# EAGLE design ElectronThingyStick (EAGLE 7.4.0)
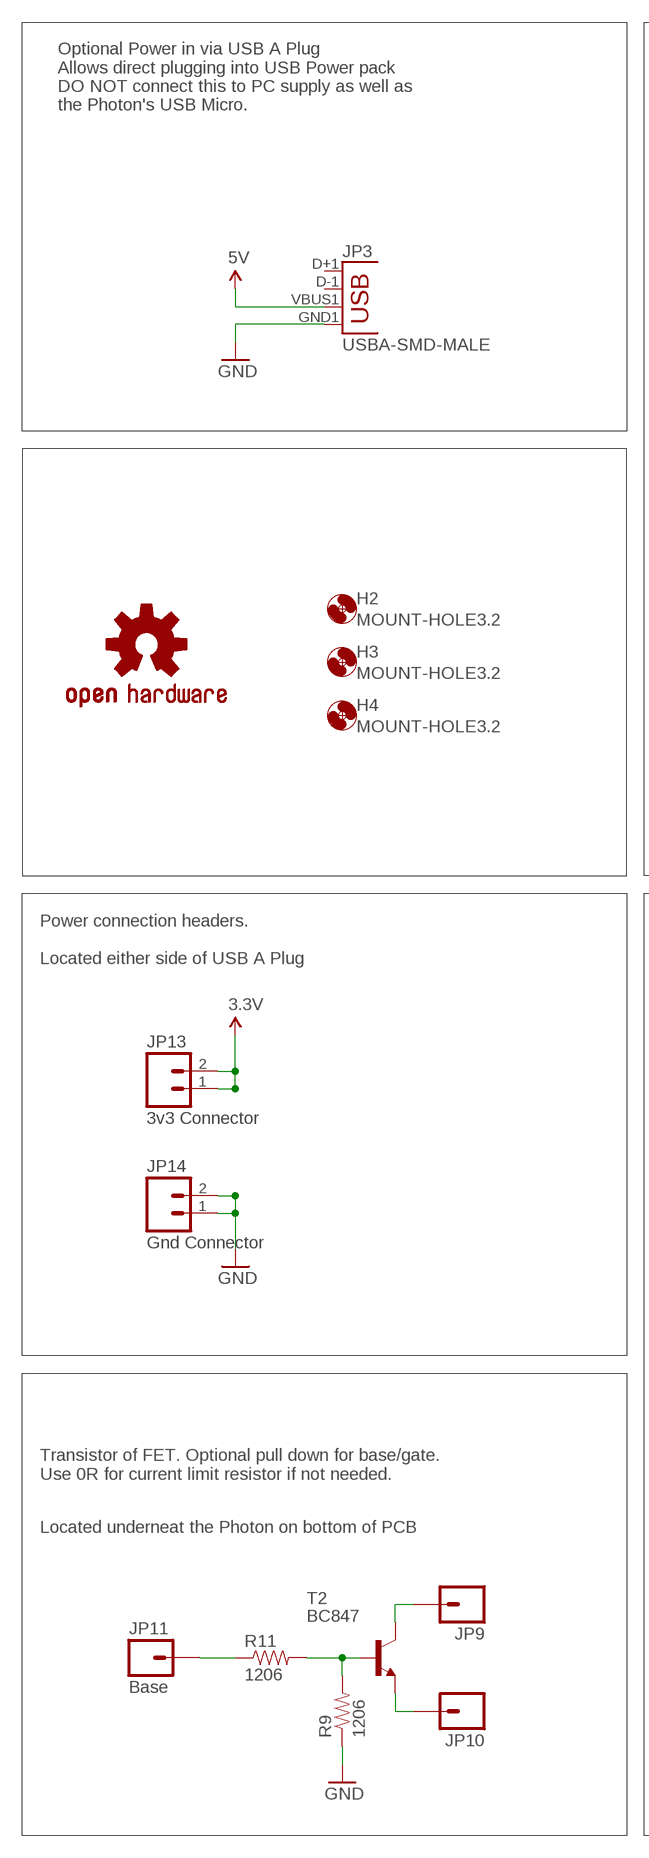
[diagram p0: schematic, sheet 1, part 1 of 2]
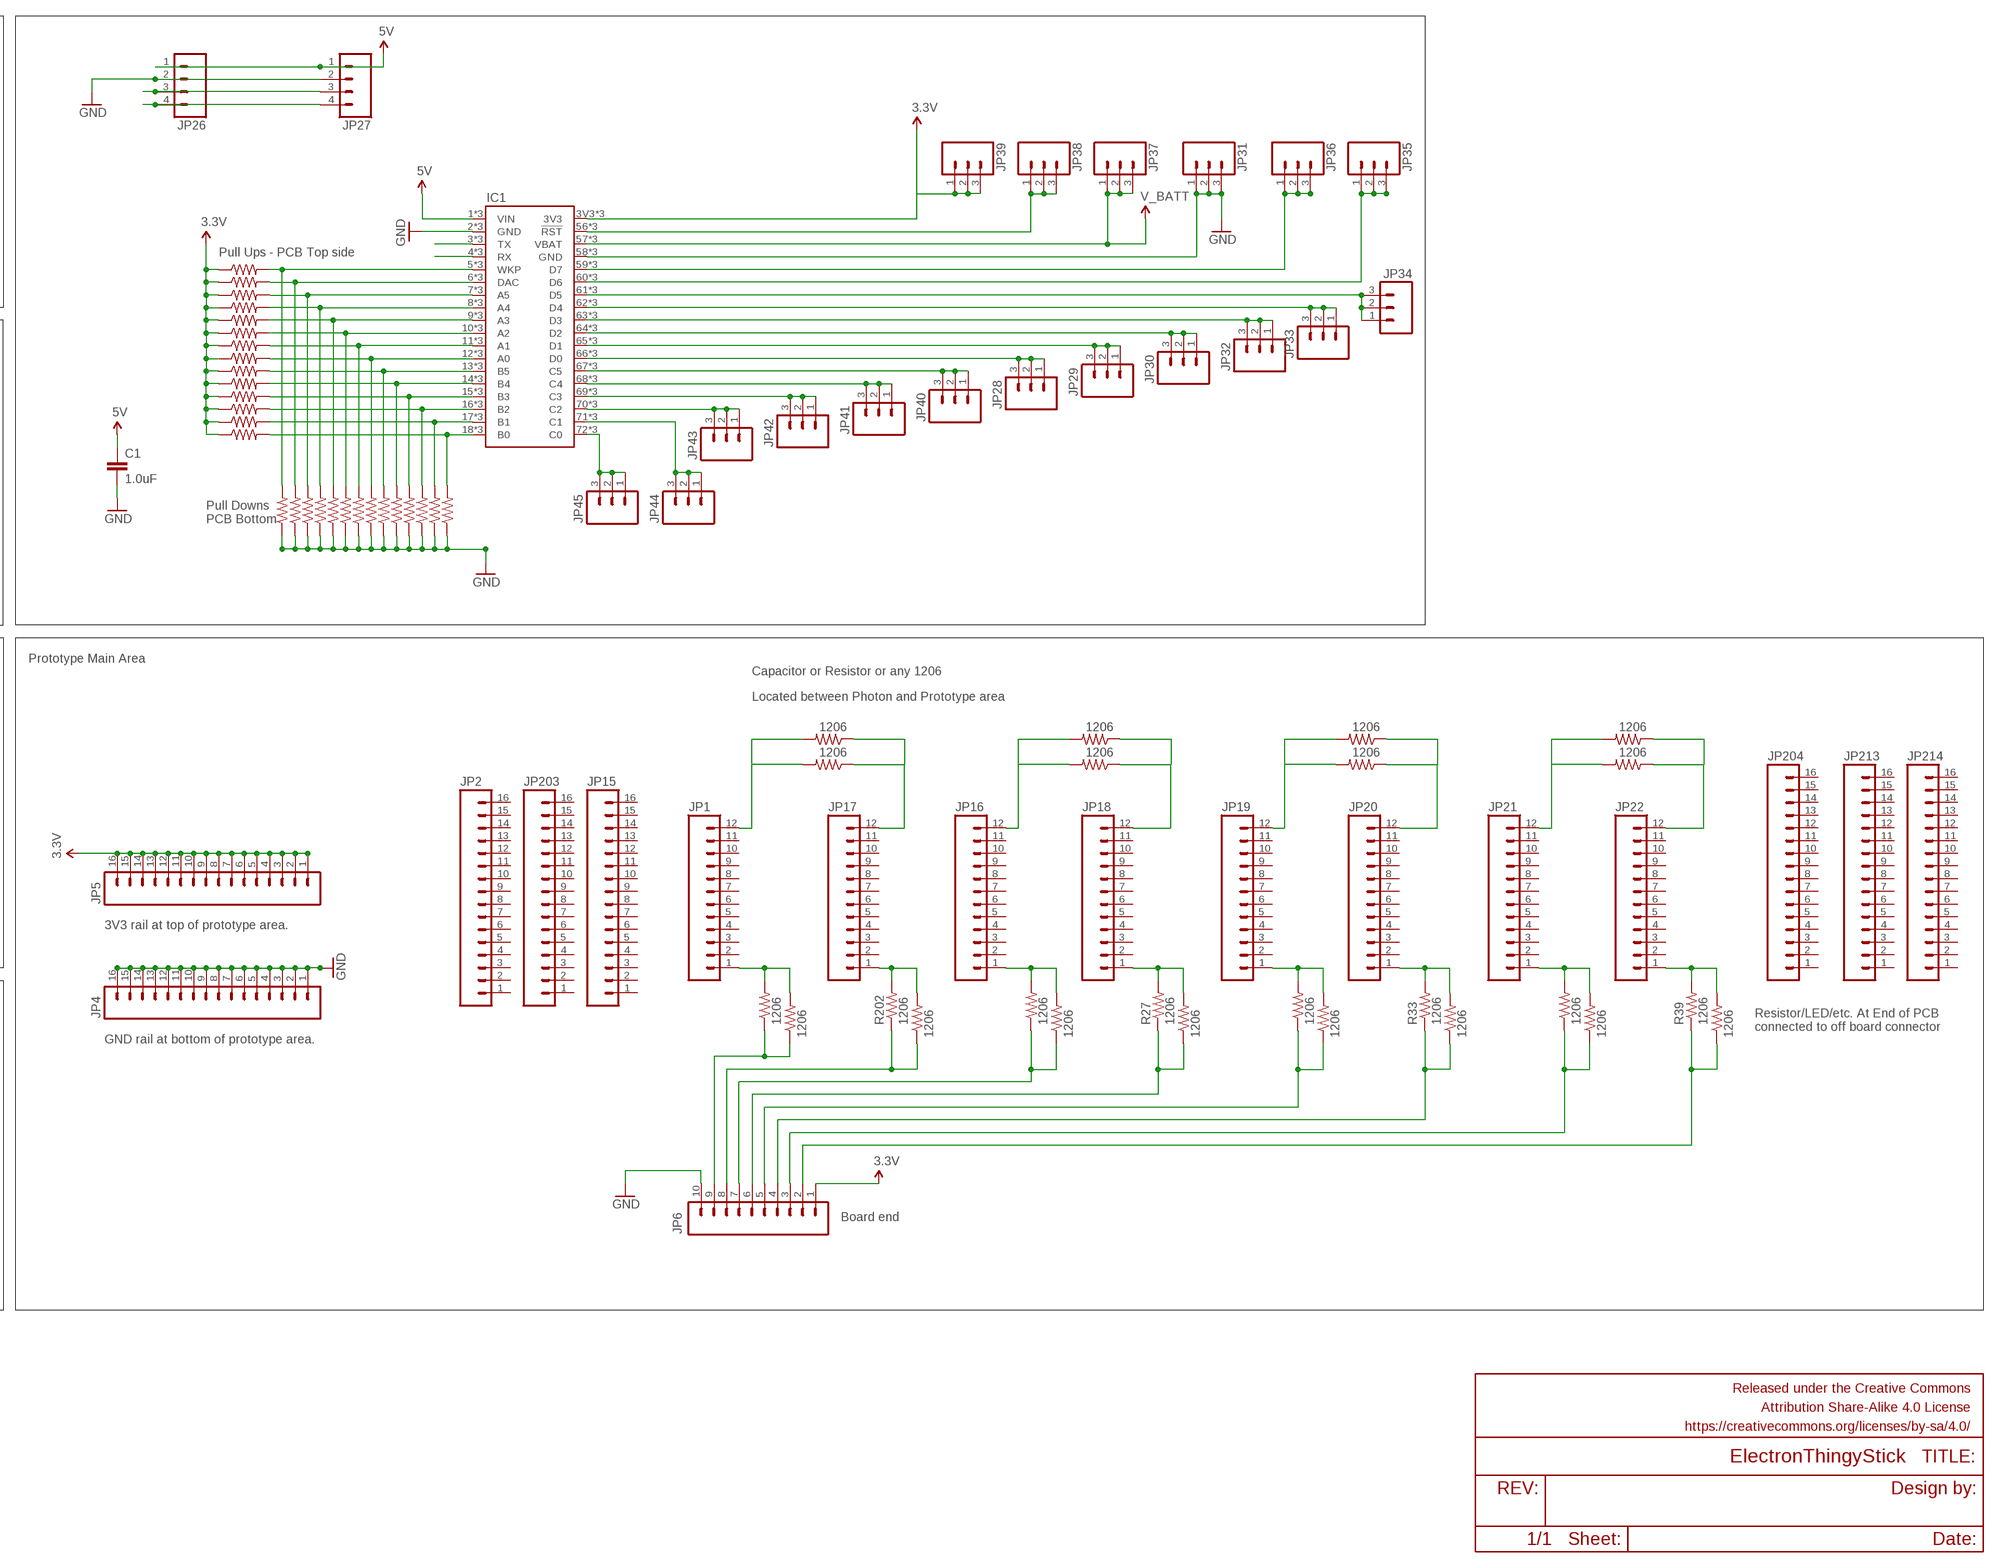
[diagram p1: schematic, sheet 1, part 2 of 2]

## Parts
C1  1.0uF  1.0UF-25V-+80/-20(0805)"  [0805-CAP]
FRAME1  FRAME-LEDGER  [CREATIVE_COMMONS]
H2  MOUNT-HOLE3.2  [3,2]
H3  MOUNT-HOLE3.2  [3,2]
H4  MOUNT-HOLE3.2  [3,2]
IC1  ELECTRONDUALROW  [ELECTRON_DUAL-ROW]
JP1  M12NO_SILK  [1X12_NO_SILK]
JP2  M161X16_NO_SILK  [1X16_NO_SILK]
JP3  USBA-SMD-MALE  [USB-A-SMT-MALE]
JP4  M16PTH  [1X16]
JP5  M16PTH  [1X16]
JP6  M10NO_SILK_PTH_FEMALE  [1X10_NO_SILK]
JP9  M01PTH  [1X01]
JP10  M01PTH  [1X01]
JP11  Base  M01PTH  [1X01]
JP13  3v3 Connector  M02PTH  [1X02]
JP14  Gnd Connector  M02PTH  [1X02]
JP15  M161X16_NO_SILK  [1X16_NO_SILK]
JP16  M12NO_SILK  [1X12_NO_SILK]
JP17  M12NO_SILK  [1X12_NO_SILK]
JP18  M12NO_SILK  [1X12_NO_SILK]
JP19  M12NO_SILK  [1X12_NO_SILK]
JP20  M12NO_SILK  [1X12_NO_SILK]
JP21  M12NO_SILK  [1X12_NO_SILK]
JP22  M12NO_SILK  [1X12_NO_SILK]
JP26  M041X04_NO_SILK  [1X04_NO_SILK]
JP27  M041X04_NO_SILK  [1X04_NO_SILK]
JP28  M03PTH  [1X03]
JP29  M03PTH  [1X03]
JP30  M03PTH  [1X03]
JP31  M03PTH  [1X03]
JP32  M03PTH  [1X03]
JP33  M03PTH  [1X03]
JP34  M03PTH  [1X03]
JP35  M03PTH  [1X03]
JP36  M03PTH  [1X03]
JP37  M03PTH  [1X03]
JP38  M03PTH  [1X03]
JP39  M03PTH  [1X03]
JP40  M03PTH  [1X03]
JP41  M03PTH  [1X03]
JP42  M03PTH  [1X03]
JP43  M03PTH  [1X03]
JP44  M03PTH  [1X03]
JP45  M03PTH  [1X03]
JP203  M161X16_NO_SILK  [1X16_NO_SILK]
JP204  M161X16_NO_SILK  [1X16_NO_SILK]
JP213  M161X16_NO_SILK  [1X16_NO_SILK]
JP214  M161X16_NO_SILK  [1X16_NO_SILK]
LOGO1  OSHW-LOGOM  [OSHW-LOGO-M]
R1  1206  RESISTOR1206  [1206]
R2  1206  RESISTOR1206  [1206]
R3  1206  RESISTOR1206  [1206]
R4  1206  RESISTOR1206  [1206]
R5  1206  RESISTOR1206  [1206]
R6  1206  RESISTOR1206  [1206]
R7  1206  RESISTOR1206  [1206]
R8  1206  RESISTOR1206  [1206]
R9  1206  RESISTOR1206  [1206]
R10  1206  RESISTOR1206  [1206]
R11  1206  RESISTOR1206  [1206]
R12  1206  RESISTOR1206  [1206]
R13  1206  RESISTOR1206  [1206]
R14  1206  RESISTOR1206  [1206]
R15  1206  RESISTOR1206  [1206]
R16  1206  RESISTOR1206  [1206]
R17  1206  RESISTOR1206  [1206]
R18  1206  RESISTOR1206  [1206]
R19  1206  RESISTOR1206  [1206]
R20  1206  RESISTOR1206  [1206]
R21  1206  RESISTOR1206  [1206]
R22  1206  RESISTOR1206  [1206]
R23  1206  RESISTOR1206  [1206]
R24  1206  RESISTOR1206  [1206]
R25  1206  RESISTOR1206  [1206]
R26  1206  RESISTOR1206  [1206]
R27  1206  RESISTOR1206  [1206]
R28  1206  RESISTOR1206  [1206]
R29  1206  RESISTOR1206  [1206]
R30  1206  RESISTOR1206  [1206]
R31  1206  RESISTOR1206  [1206]
R32  1206  RESISTOR1206  [1206]
R33  1206  RESISTOR1206  [1206]
R34  1206  RESISTOR1206  [1206]
R35  1206  RESISTOR1206  [1206]
R36  1206  RESISTOR1206  [1206]
R37  1206  RESISTOR1206  [1206]
R38  1206  RESISTOR1206  [1206]
R39  1206  RESISTOR1206  [1206]
R40  1206  RESISTOR1206  [1206]
R41  1206  RESISTOR1206  [1206]
R42  1206  RESISTOR1206  [1206]
R43  1206  RESISTOR1206  [1206]
R44  1206  RESISTOR1206  [1206]
R45  1206  RESISTOR1206  [1206]
R46  1206  RESISTOR1206  [1206]
R47  1206  RESISTOR1206  [1206]
R48  1206  RESISTOR1206  [1206]
R49  1206  RESISTOR1206  [1206]
R50  1206  RESISTOR1206  [1206]
R51  1206  RESISTOR1206  [1206]
R52  1206  RESISTOR1206  [1206]
R201  1206  RESISTOR1206  [1206]
R202  1206  RESISTOR1206  [1206]
T2  BC847  [SOT23]

## Nets
3.3V: IC1.3V3 IC1.55(3V3) IC1.91(3V3) JP5.1 JP5.2 JP5.3 JP5.4 JP5.5 JP5.6 JP5.7 JP5.8 JP5.9 JP5.10 JP5.11 JP5.12 JP5.13 JP5.14 JP5.15 JP5.16 JP6.1 JP13.1 JP13.2 JP39.1 JP39.2 JP39.3 R1.1 R2.1 R3.1 R4.1 R5.1 R6.1 R7.1 R12.1 R15.1 R16.1 R17.1 R18.1 R45.1 R46.1
5V: C1.1 IC1.1(VIN) IC1.37(VIN) IC1.VIN JP3.VBUS1(VBUS) JP26.1 JP27.1
GND: C1.2 IC1.2(GND) IC1.38(GND) IC1.58(GND) IC1.94(GND) IC1.GND IC1.GND@2(GND) JP3.GND1(GND) JP4.1 JP4.2 JP4.3 JP4.4 JP4.5 JP4.6 JP4.7 JP4.8 JP4.9 JP4.10 JP4.11 JP4.12 JP4.13 JP4.14 JP4.15 JP4.16 JP6.10 JP14.1 JP14.2 JP26.2 JP27.2 JP31.1 JP31.2 JP31.3 R8.1 R9.1 R10.1 R13.1 R14.1 R19.1 R20.1 R21.1 R22.1 R47.1 R48.1 R49.1 R50.1 R51.1 R52.1
N$1: IC1.67(C5) IC1.103(C5) IC1.C5 JP40.1 JP40.2 JP40.3
N$2: JP17.1 R26.2 R202.2
N$3: JP1.1 R23.2 R201.2
N$4: IC1.68(C4) IC1.104(C4) IC1.C4 JP41.1 JP41.2 JP41.3
N$5: IC1.69(C3) IC1.105(C3) IC1.C3 JP42.1 JP42.2 JP42.3
N$6: IC1.5(WKP) IC1.41(WKP) IC1.WKP R8.2 R12.2
N$7: IC1.6(DAC) IC1.42(DAC) IC1.DAC R5.2 R10.2
N$8: IC1.7(A5) IC1.43(A5) IC1.A5 R1.2 R13.2
N$9: IC1.8(A4) IC1.44(A4) IC1.A4 R2.2 R14.2
N$10: IC1.9(A3) IC1.45(A3) IC1.A3 R3.2 R19.2
N$11: IC1.10(A2) IC1.46(A2) IC1.A2 R4.2 R20.2
N$12: IC1.11(A1) IC1.47(A1) IC1.A1 R6.2 R21.2
N$13: IC1.12(A0) IC1.48(A0) IC1.A0 R7.2 R22.2
N$14: JP6.9 R23.1 R201.1
N$15: IC1.70(C2) IC1.106(C2) IC1.C2 JP43.1 JP43.2 JP43.3
N$16: IC1.61(D5) IC1.97(D5) IC1.D5 JP34.1 JP34.2 JP34.3
N$17: IC1.62(D4) IC1.98(D4) IC1.D4 JP33.1 JP33.2 JP33.3
N$18: IC1.63(D3) IC1.99(D3) IC1.D3 JP32.1 JP32.2 JP32.3
N$19: IC1.64(D2) IC1.100(D2) IC1.D2 JP30.1 JP30.2 JP30.3
N$20: IC1.65(D1) IC1.101(D1) IC1.D1 JP29.1 JP29.2 JP29.3
N$21: IC1.66(D0) IC1.102(D0) IC1.D0 JP28.1 JP28.2 JP28.3
N$22: IC1.13(B5) IC1.49(B5) IC1.B5 R15.2 R47.2
N$23: JP1.12 R24.2 R25.2
N$24: IC1.56(!RST) IC1.92(!RST) IC1.RST(!RST) JP38.1 JP38.2 JP38.3
N$25: IC1.71(C1) IC1.107(C1) IC1.C1 JP44.1 JP44.2 JP44.3
N$26: JP17.12 R24.1 R25.1
N$27: IC1.72(C0) IC1.108(C0) IC1.C0 JP45.1 JP45.2 JP45.3
N$28: JP6.8 R26.1 R202.1
N$29: JP18.1 R27.2 R32.2
N$30: JP16.1 R28.2 R29.2
N$31: JP6.7 R28.1 R29.1
N$32: IC1.14(B4) IC1.50(B4) IC1.B4 R16.2 R48.2
N$33: JP16.12 R30.2 R31.2
N$34: JP18.12 R30.1 R31.1
N$35: IC1.15(B3) IC1.51(B3) IC1.B3 R17.2 R49.2
N$36: JP6.6 R27.1 R32.1
N$37: JP20.1 R33.2 R38.2
N$38: IC1.59(D7) IC1.95(D7) IC1.D7 JP36.1 JP36.2 JP36.3
N$39: IC1.60(D6) IC1.96(D6) IC1.D6 JP35.1 JP35.2 JP35.3
N$40: JP19.1 R34.2 R35.2
N$41: IC1.16(B2) IC1.52(B2) IC1.B2 R18.2 R50.2
N$43: JP6.5 R34.1 R35.1
N$44: IC1.17(B1) IC1.53(B1) IC1.B1 R45.2 R51.2
N$45: IC1.18(B0) IC1.54(B0) IC1.B0 R46.2 R52.2
N$53: JP19.12 R36.2 R37.2
N$54: JP20.12 R36.1 R37.1
N$57: JP6.4 R33.1 R38.1
N$58: JP22.1 R39.2 R44.2
N$59: JP11.1 R11.1
N$60: R9.2 R11.2 T2.1(B)
N$61: JP9.1 T2.3(C)
N$62: JP10.1 T2.2(E)
N$63: JP21.1 R40.2 R41.2
N$64: JP6.3 R40.1 R41.1
N$68: JP21.12 R42.2 R43.2
N$69: JP22.12 R42.1 R43.1
N$72: JP6.2 R39.1 R44.1
RX: IC1.4(RX) IC1.40(RX) IC1.RX JP26.4 JP27.4
TX: IC1.3(TX) IC1.39(TX) IC1.TX JP26.3 JP27.3
V_BATT: IC1.57(VBAT) IC1.93(VBAT) IC1.VBAT JP37.1 JP37.2 JP37.3
Unconnected: JP1.2 JP1.3 JP1.4 JP1.5 JP1.6 JP1.7 JP1.8 JP1.9 JP1.10 JP1.11 JP2.1 JP2.2 JP2.3 JP2.4 JP2.5 JP2.6 JP2.7 JP2.8 JP2.9 JP2.10 JP2.11 JP2.12 JP2.13 JP2.14 JP2.15 JP2.16 JP3.D+1(D+) JP3.D-1(D-) JP15.1 JP15.2 JP15.3 JP15.4 JP15.5 JP15.6 JP15.7 JP15.8 JP15.9 JP15.10 JP15.11 JP15.12 JP15.13 JP15.14 JP15.15 JP15.16 JP16.2 JP16.3 JP16.4 JP16.5 JP16.6 JP16.7 JP16.8 JP16.9 JP16.10 JP16.11 JP17.2 JP17.3 JP17.4 JP17.5 JP17.6 JP17.7 JP17.8 JP17.9 JP17.10 JP17.11 JP18.2 JP18.3 JP18.4 JP18.5 JP18.6 JP18.7 JP18.8 JP18.9 JP18.10 JP18.11 JP19.2 JP19.3 JP19.4 JP19.5 JP19.6 JP19.7 JP19.8 JP19.9 JP19.10 JP19.11 JP20.2 JP20.3 JP20.4 JP20.5 JP20.6 JP20.7 JP20.8 JP20.9 JP20.10 JP20.11 JP21.2 JP21.3 JP21.4 JP21.5 JP21.6 JP21.7 JP21.8 JP21.9 JP21.10 JP21.11 JP22.2 JP22.3 JP22.4 JP22.5 JP22.6 JP22.7 JP22.8 JP22.9 JP22.10 JP22.11 JP203.1 JP203.2 JP203.3 JP203.4 JP203.5 JP203.6 JP203.7 JP203.8 JP203.9 JP203.10 JP203.11 JP203.12 JP203.13 JP203.14 JP203.15 JP203.16 JP204.1 JP204.2 JP204.3 JP204.4 JP204.5 JP204.6 JP204.7 JP204.8 JP204.9 JP204.10 JP204.11 JP204.12 JP204.13 JP204.14 JP204.15 JP204.16 JP213.1 JP213.2 JP213.3 JP213.4 JP213.5 JP213.6 JP213.7 JP213.8 JP213.9 JP213.10 JP213.11 JP213.12 JP213.13 JP213.14 JP213.15 JP213.16 JP214.1 JP214.2 JP214.3 JP214.4 JP214.5 JP214.6 JP214.7 JP214.8 JP214.9 JP214.10 JP214.11 JP214.12 JP214.13 JP214.14 JP214.15 JP214.16

## Notes on the sheet
- Optional Power in via USB A Plug
  Allows direct plugging into USB Power pack
  DO NOT connect this to PC supply as well as
  the Photon's USB Micro.
- Pull Ups - PCB Top side
- Pull Downs
  PCB Bottom
- Prototype Main Area
- Capacitor or Resistor or any 1206
- Power connection headers.
  
  Located either side of USB A Plug
- Located between Photon and Prototype area
- 3V3 rail at top of prototype area.
- Resistor/LED/etc. At End of PCB 
  connected to off board connector
- GND rail at bottom of prototype area.
- Transistor of FET. Optional pull down for base/gate.
  Use 0R for current limit resistor if not needed.
- Located underneat the Photon on bottom of PCB
- Board end

## Library data of the parts
C1 = SparkFun-Capacitors:1.0UF-25V-+80/-20(0805): CAP-11625; PROD_ID: CAP-11625
FRAME1 = SparkFun-Aesthetics:FRAME-LEDGER: Schematic Frame Standard 11x14 US Ledger frame
H2-H4 = holes:MOUNT-HOLE: MOUNTING HOLE with drill center marker
IC1 = Tinamous:ELECTRON
JP1 JP16-JP22 = SparkFun-Connectors:M12: Header 12 Standard 12-pin 0.1" header. Use with straight break away headers (SKU : PRT-00116), right angle break away headers (PRT-00553), swiss pins (PRT-00743), machine pins (PRT-00117), and female headers (PRT-00115).
JP2 JP4 JP5 JP15 JP203 JP204 JP213 JP214 = SparkFun-Connectors:M16: 1x16 .1" header
JP3 = SparkFun-Connectors:USB: USB Connectors USB-B-PTH is fully proven SKU : PRT-00139/CONN-08278 USB-miniB is fully proven SKU : PRT-00587 USB-A-PCB is untested. USB-A-H is throughly reviewed, but untested. Spark Fun Electronics SKU : PRT-00437 USB-B-SMT is throughly reviewed, but untested. Needs silkscreen touching up. USB-A-S has not been used/tested USB-MB-H has not been used/tested USB-MICROB has been used. CONN-09505
JP6 = SparkFun-Connectors:M10: Header 10 Standard 10-pin 0.1" header. Use with straight break away headers (SKU : PRT-00116), right angle break away headers (PRT-00553), swiss pins (PRT-00743), machine pins (PRT-00117), and female headers (PRT-00115).; PROD_ID: CONN-11563
JP9-JP11 = SparkFun-Connectors:M01: Header 1 Standard 1-pin 0.1" header. Use with straight break away headers (SKU : PRT-00116), right angle break away headers (PRT-00553), swiss pins (PRT-00743), machine pins (PRT-00117), and female headers (PRT-00115).
JP13 JP14 = SparkFun-Connectors:M02: Standard 2-pin 0.1" header. Use with - straight break away headers ( PRT-00116) - right angle break away headers (PRT-00553) - swiss pins (PRT-00743) - machine pins (PRT-00117) - female headers (PRT-00115) Molex polarized connector foot print use with: PRT-08233 with associated crimp pins and housings. 2.54_SCREWTERM for use with PRT-10571. 3.5mm Screw Terminal footprints for PRT-08084 5mm Screw Terminal footprints for use with PRT-08432
JP26 JP27 = SparkFun-Connectors:M04: Header 4 Standard 4-pin 0.1" header. Use with straight break away headers (SKU : PRT-00116), right angle break away headers (PRT-00553), swiss pins (PRT-00743), machine pins (PRT-00117), and female headers (PRT-00115). Molex polarized connector foot print use with SKU : PRT-08231 with associated crimp pins and housings. 1MM SMD Version SKU: PRT-10208
JP28-JP45 = SparkFun-Connectors:M03: Header 3 Standard 3-pin 0.1" header. Use with straight break away headers (SKU : PRT-00116), right angle break away headers (PRT-00553), swiss pins (PRT-00743), machine pins (PRT-00117), and female headers (PRT-00115). Molex polarized connector foot print use with SKU : PRT-08232 with associated crimp pins and housings.
LOGO1 = SparkFun-Aesthetics:OSHW-LOGO: Open Source Hardware Logo This logo indicates the piece of hardware it is found on incorporates a OSHW license and/or adheres to the definition of open source hardware found here: http://freedomdefined.org/OSHW
R1-R8 R10 R12-R52 R201 R202 = SparkFun-Resistors:RESISTOR: Resistor Basic schematic elements and footprints for 0603, 1206, and PTH resistors.
R9 R11 = SparkFun-Passives:RESISTOR: Resistor Basic schematic elements and footprints for 0603, 1206, and PTH resistors.
T2 = transistor-neu-to92:BC847: NPN TRANSISTOR

## Board
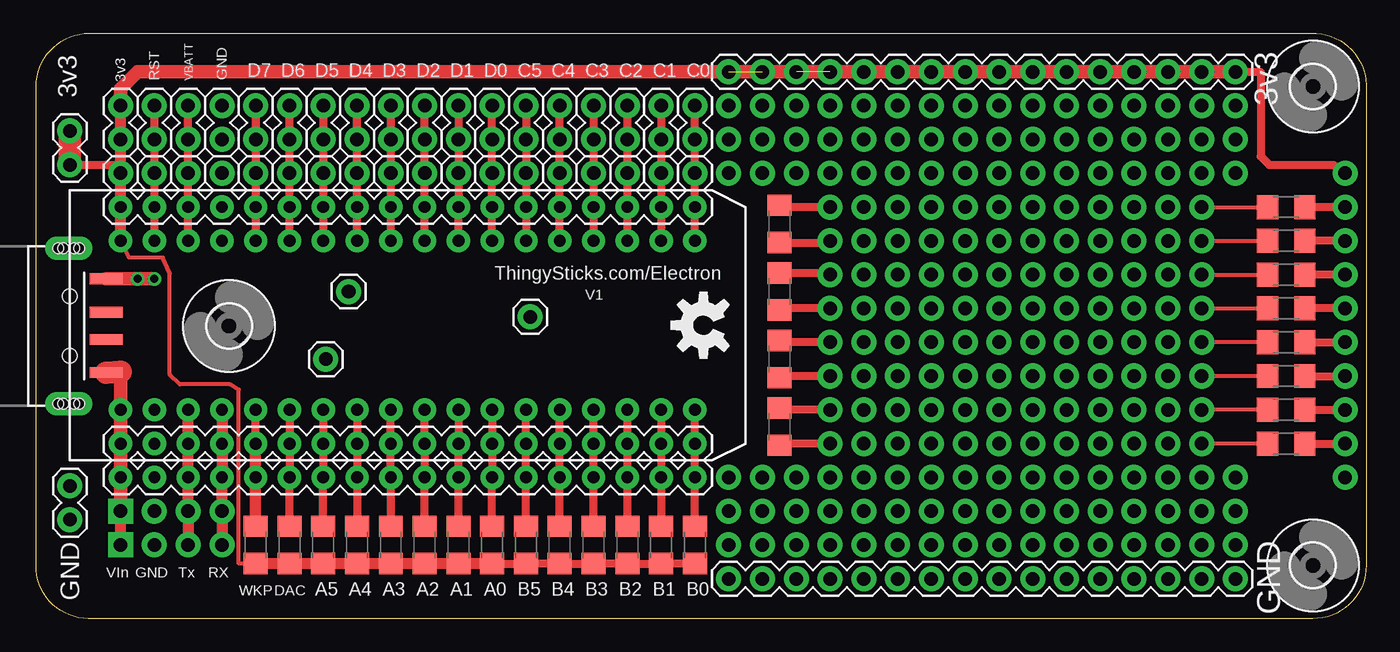
[diagram p2: board, top side]
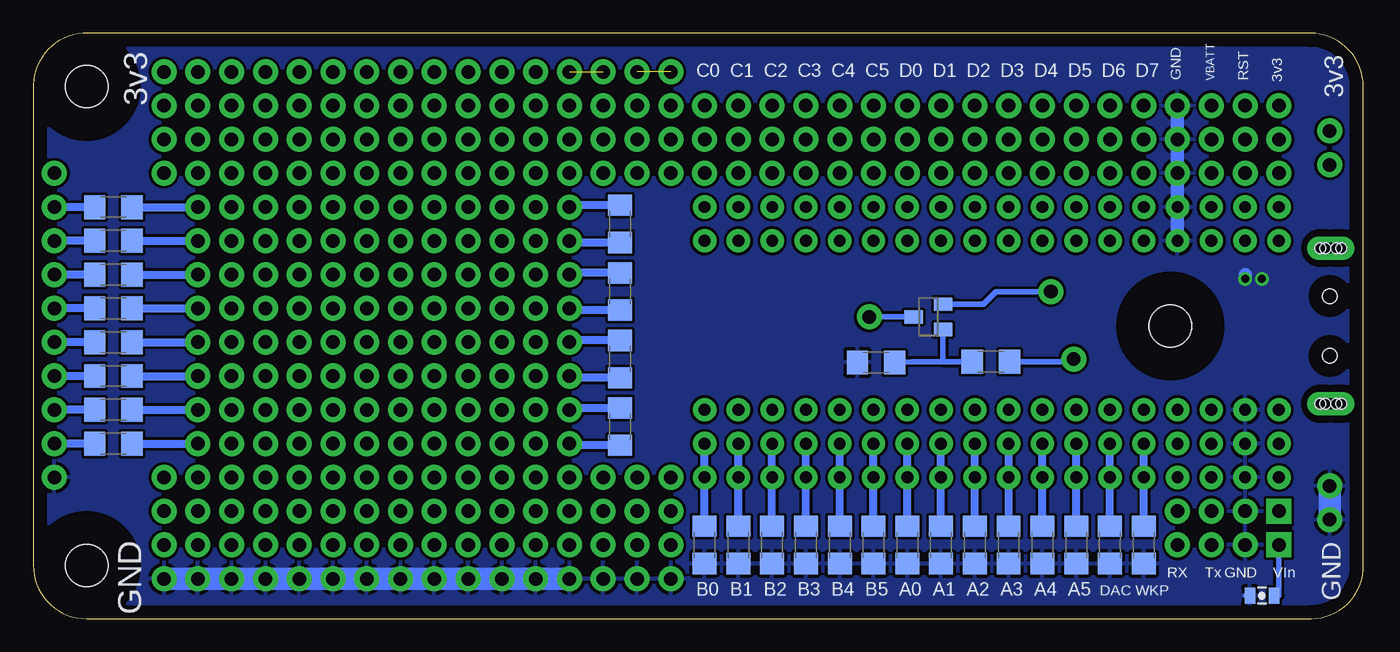
[diagram p3: board, bottom side, seen from below]

Size 100.01 x 44 mm. Coordinates in mm from the lower left corner, seen from the top.
Outline: 0,4 arc90 3.9,0 96,0 arc90 100,4 100,39.75 arc90 96.25,44 4,44 arc90 0,40 0,3.72
Copper layers (1*16): Top 0.035mm / dielectric 1.5mm / Bottom 0.035mm
Design rules "default": minimum track width 10mil, minimum drill 24mil, track to track 8mil, track to pad 8mil, pad to pad 8mil, via to via 8mil, smd to smd 8mil, copper to edge 40mil, drill to drill 8mil, minimum pad ring 10mil, minimum via ring 8mil, stop-mask expansion 4mil, vias tented up to drill 0mil, thermal gap 10mil

### Footprints (pad centres in the part's own frame; a part is rotated, then mirrored left to right if it is on the bottom)
0805-CAP = smd 0.8 x 1.2: 1 -0.9,0; 2 0.9,0
3,2 = hole 3.2: 0,0
ELECTRON_DUAL-ROW = drill 0.889 pad 1.753: 1 1.27,2.54; 2 3.81,2.54; 3 6.35,2.54; 3V3 1.27,22.86; 4 8.89,2.54; 5 11.43,2.54; 6 13.97,2.54; 7 16.51,2.54; 8 19.05,2.54; 9 21.59,2.54; 10 24.13,2.54; 11 26.67,2.54; 12 29.21,2.54; 13 31.75,2.54; 14 34.29,2.54; 15 36.83,2.54; 16 39.37,2.54; 17 41.91,2.54; 18 44.45,2.54; 37 1.27,7.62; 38 3.81,7.62; 39 6.35,7.62; 40 8.89,7.62; 41 11.43,7.62; 42 13.97,7.62; 43 16.51,7.62; 44 19.05,7.62; 45 21.59,7.62; 46 24.13,7.62; 47 26.67,7.62; 48 29.21,7.62; 49 31.75,7.62; 50 34.29,7.62; 51 36.83,7.62; 52 39.37,7.62; 53 41.91,7.62; 54 44.45,7.62; 55 1.27,20.32; 56 3.81,20.32; 57 6.35,20.32; 58 8.89,20.32; 59 11.43,20.32; 60 13.97,20.32; 61 16.51,20.32; 62 19.05,20.32; 63 21.59,20.32; 64 24.13,20.32; 65 26.67,20.32; 66 29.21,20.32; 67 31.75,20.32; 68 34.29,20.32; 69 36.83,20.32; 70 39.37,20.32; 71 41.91,20.32; 72 44.45,20.32; 91 1.27,25.4; 92 3.81,25.4; 93 6.35,25.4; 94 8.89,25.4; 95 11.43,25.4; 96 13.97,25.4; 97 16.51,25.4; 98 19.05,25.4; 99 21.59,25.4; 100 24.13,25.4; 101 26.67,25.4; 102 29.21,25.4; 103 31.75,25.4; 104 34.29,25.4; 105 36.83,25.4; 106 39.37,25.4; 107 41.91,25.4; 108 44.45,25.4; A0 29.21,5.08; A1 26.67,5.08; A2 24.13,5.08; A3 21.59,5.08; A4 19.05,5.08; A5 16.51,5.08; B0 44.45,5.08; B1 41.91,5.08; B2 39.37,5.08; B3 36.83,5.08; B4 34.29,5.08; B5 31.75,5.08; C0 44.45,22.86; C1 41.91,22.86; C2 39.37,22.86; C3 36.83,22.86; C4 34.29,22.86; C5 31.75,22.86; D0 29.21,22.86; D1 26.67,22.86; D2 24.13,22.86; D3 21.59,22.86; D4 19.05,22.86; D5 16.51,22.86; D6 13.97,22.86; D7 11.43,22.86; DAC 13.97,5.08; GND 8.89,22.86; GND@2 3.81,5.08; RST 3.81,22.86; RX 8.89,5.08; TX 6.35,5.08; VBAT 6.35,22.86; VIN 1.27,5.08; WKP 11.43,5.08
1X12_NO_SILK = drill 1.016 pad 1.88: 1 0,0; 2 2.54,0; 3 5.08,0; 4 7.62,0; 5 10.16,0; 6 12.7,0; 7 15.24,0; 8 17.78,0; 9 20.32,0; 10 22.86,0; 11 25.4,0; 12 27.94,0
1X16_NO_SILK = drill 1.016 pad 1.88: 1 0,0; 2 2.54,0; 3 5.08,0; 4 7.62,0; 5 10.16,0; 6 12.7,0; 7 15.24,0; 8 17.78,0; 9 20.32,0; 10 22.86,0; 11 25.4,0; 12 27.94,0; 13 30.48,0; 14 33.02,0; 15 35.56,0; 16 38.1,0
USB-A-SMT-MALE = smd 0.8 x 2.5: D+1 1.027,-5.87; D-1 -1.027,-5.87; GND1 3.551,-5.87; VBUS1 -3.5,-5.87 | drill 0.8 pad 1.778 long: P$1 5.85,-3.05; P$3 -5.85,-3.05 | hole 1.1: 2.25,-3.12; -2.25,-3.12 | hole 0.8: -5.85,-3.45; -5.85,-3.85; -5.85,-2.65; -5.85,-2.25; 5.85,-3.45; 5.85,-3.85; 5.85,-2.65; 5.85,-2.25
1X16 = drill 1.016 pad 1.88: 1 0,0; 2 2.54,0; 3 5.08,0; 4 7.62,0; 5 10.16,0; 6 12.7,0; 7 15.24,0; 8 17.78,0; 9 20.32,0; 10 22.86,0; 11 25.4,0; 12 27.94,0; 13 30.48,0; 14 33.02,0; 15 35.56,0; 16 38.1,0
1X10_NO_SILK = drill 1.016 pad 1.88: 1 0,0; 2 2.54,0; 3 5.08,0; 4 7.62,0; 5 10.16,0; 6 12.7,0; 7 15.24,0; 8 17.78,0; 9 20.32,0; 10 22.86,0
1X01 = drill 1.016 pad 1.88: 1 0,0
1X02 = drill 1.016 pad 1.88: 1 0,0; 2 2.54,0
1X04_NO_SILK = drill 1.016 pad 1.88 square: 1 0,0 | drill 1.016 pad 1.88: 2 2.54,0; 3 5.08,0; 4 7.62,0
1X03 = drill 1.016 pad 1.88: 1 0,0; 2 2.54,0; 3 5.08,0
1206 = smd 1.6 x 1.8: 1 -1.4,0; 2 1.4,0
SOT23 = smd 1 x 1.4: 1 -0.95,-1.1; 2 0.95,-1.1; 3 0,1.1

### Placement (x,y rotation side)
C1  7.62,1.73 180 bottom
FRAME1  23.36,-13.27 0 top  (outside the outline)
H2  14.5,22 0 top
H3  96,40 0 top
H4  96,4 0 top
IC1  5.08,8.08 0 top
JP1  87.63,13.16 180 top
JP2  90.17,38.56 180 top
JP3  -0.6,22 90 top
JP4  90.17,3 180 top
JP5  90.17,41.1 180 top
JP6  98.42,33.48 270 top
JP9  37.15,22.68 0 top
JP10  23.5,24.59 0 top
JP11  21.78,19.51 0 top
JP13  2.54,34.11 90 top
JP14  2.54,9.98 270 top
JP15  90.17,5.54 180 top
JP16  87.63,18.24 180 top
JP17  87.63,15.7 180 top
JP18  87.63,20.78 180 top
JP19  87.63,23.32 180 top
JP20  87.63,25.86 180 top
JP21  87.63,28.4 180 top
JP22  87.63,30.94 180 top
JP26  6.35,5.54 0 top
JP27  6.35,8.08 0 top
JP28  34.29,33.48 90 top
JP29  31.75,33.48 90 top
JP30  29.21,38.56 270 top
JP31  13.97,33.48 90 top
JP32  26.67,38.56 270 top
JP33  24.13,38.56 270 top
JP34  21.59,38.56 270 top
JP35  19.05,38.56 270 top
JP36  16.51,38.56 270 top
JP37  11.43,33.48 90 top
JP38  8.89,33.48 90 top
JP39  6.35,33.48 90 top
JP40  36.83,33.48 90 top
JP41  39.37,33.48 90 top
JP42  41.91,33.48 90 top
JP43  44.45,33.48 90 top
JP44  46.99,33.48 90 top
JP45  49.53,33.48 90 top
JP203  90.17,36.02 180 top
JP204  90.17,33.48 180 top
JP213  90.17,10.62 180 top
JP214  90.17,8.08 180 top
LOGO1  50.16,22.05 90 top
R1  21.59,5.54 90 top
R2  24.13,5.54 90 top
R3  26.67,5.54 90 top
R4  29.21,5.54 90 top
R5  19.05,5.54 90 top
R6  31.75,5.54 90 top
R7  34.29,5.54 90 top
R8  16.51,5.54 90 bottom
R9  36.64,19.26 0 bottom
R10  19.05,5.54 90 bottom
R11  28,19.32 180 bottom
R12  16.51,5.54 90 top
R13  21.59,5.54 90 bottom
R14  24.13,5.54 90 bottom
R15  36.83,5.54 90 top
R16  39.37,5.54 90 top
R17  41.91,5.54 90 top
R18  44.45,5.54 90 top
R19  26.67,5.54 90 bottom
R20  29.21,5.54 90 bottom
R21  31.75,5.54 90 bottom
R22  34.29,5.54 90 bottom
R23  93.98,13.16 0 bottom
R24  55.88,14.43 270 top
R25  55.88,14.43 270 bottom
R26  93.98,15.7 0 bottom
R27  93.98,20.78 180 top
R28  93.98,18.24 180 top
R29  93.98,18.24 0 bottom
R30  55.88,19.51 270 top
R31  55.88,19.51 270 bottom
R32  93.98,20.78 0 bottom
R33  93.98,25.86 180 top
R34  93.98,23.32 180 top
R35  93.98,23.32 0 bottom
R36  55.88,24.59 270 top
R37  55.88,24.59 270 bottom
R38  93.98,25.86 0 bottom
R39  93.98,30.94 180 top
R40  93.98,28.4 180 top
R41  93.98,28.4 0 bottom
R42  55.88,29.67 270 top
R43  55.88,29.67 270 bottom
R44  93.98,30.94 0 bottom
R45  46.99,5.54 90 top
R46  49.53,5.54 90 top
R47  36.83,5.54 90 bottom
R48  39.37,5.54 90 bottom
R49  41.91,5.54 90 bottom
R50  44.45,5.54 90 bottom
R51  46.99,5.54 90 bottom
R52  49.53,5.54 90 bottom
R201  93.98,13.16 180 top
R202  93.98,15.7 180 top
T2  32.7,22.68 90 bottom

### Tracks (layer width: path | path; a pad name or v marks a point on that pad's centre or on a via)
3.3V  (2 unrouted)
  Top 0.305: R12.1 15.24,4.14 15.24,17.22 14.61,17.61 10.79,17.61 10.06,18.34 10.06,25.96 9.53,27.13 6.99,27.13 IC1.55
  Top 0.61: JP5.1 92.08,41.1 92.08,34.75 92.71,34.11 97.54,34.11 JP6.1 | R7.1 R15.1 R16.1 R17.1 R18.1 R45.1 R46.1 | JP13.1 6.35,34.11 IC1.91 | IC1.3V3 JP39.2
  Top 0.813: R7.1 R6.1 R4.1 R3.1 R2.1 R1.1 R5.1 R12.1 | IC1.55 IC1.3V3 IC1.91 JP39.2 JP39.3
  Top 1.016: JP5.1 JP5.2 JP5.3 JP5.4 JP5.5 JP5.6 JP5.7 JP5.8 JP5.9 JP5.10 JP5.11 JP5.12 JP5.13 JP5.15 7.62,41.1 6.35,39.83 JP39.3
  Top 1.676: JP13.2 JP13.1
5V
  Top 0.813: JP26.1 JP27.1
  Top 1.016: 6.35,18.55 IC1.37 IC1.VIN IC1.1 JP27.1
  Top 1.676: JP3.VBUS1 6.35,18.55
  Bottom 0.406: C1.1 6.35,1.73 JP26.1
GND  (via drill 0.6)
  Top 1.016: JP3.GND1 6.99,25.55 v8.89,25.54
  Bottom 0.406: C1.2 8.89,1.73
  Bottom 1.016: v8.89,25.54 8.89,25.86 | JP31.3 JP31.2 IC1.94 IC1.GND IC1.58
  Bottom 1.676: JP4.1 JP4.2 JP4.3 JP4.4 JP4.5 JP4.6 JP4.7 JP4.8 JP4.9 JP4.10 JP4.11 JP4.12 JP4.13 | JP14.1 JP14.2
  other vias: 7.62,25.54
  pour Bottom: -0.44,-0.48 100.75,-0.67 100.56,44.86 -0.34,44.91
N$1
  Top 0.61: JP40.3 JP40.2 IC1.103 IC1.C5 IC1.67
N$2
  Top 0.305: R26.2 JP17.1
  Bottom 0.61: R26.2 JP17.1
N$3
  Top 0.305: R23.2 JP1.1
  Bottom 0.61: R23.2 JP1.1
N$4
  Top 0.61: IC1.68 IC1.C4 IC1.104 JP41.2 JP41.3
N$5
  Top 0.61: JP42.3 JP42.2 IC1.105 IC1.C3 IC1.69
N$6
  Top 0.61: IC1.WKP IC1.41
  Top 0.813: R8.2 IC1.5 IC1.WKP
  Bottom 0.61: R8.2 IC1.WKP
N$7
  Top 0.61: R10.2 IC1.6 IC1.DAC IC1.42
  Bottom 0.61: R10.2 IC1.DAC
N$8
  Top 0.61: R13.2 IC1.7 IC1.A5 IC1.43
  Bottom 0.61: R13.2 IC1.A5
N$9
  Top 0.61: R14.2 IC1.8 IC1.A4 IC1.44
  Bottom 0.61: R14.2 IC1.A4
N$10
  Top 0.61: R19.2 IC1.9 IC1.A3 IC1.45
  Bottom 0.61: R19.2 IC1.A3
N$11
  Top 0.61: R20.2 IC1.10 IC1.A2 IC1.46
  Bottom 0.61: R20.2 IC1.A2
N$12
  Top 0.61: IC1.11 R21.2 IC1.A1 IC1.47
  Bottom 0.61: R21.2 IC1.A1
N$13
  Top 0.61: R22.2 IC1.12 IC1.A0 IC1.48
  Bottom 0.61: R22.2 IC1.A0
N$14
  Top 0.61: R23.1 JP6.9
  Bottom 0.61: R23.1 JP6.9
N$15
  Top 0.61: IC1.70 IC1.C2 IC1.106 JP43.2 JP43.3
N$16
  Top 0.61: JP34.1 JP34.2 IC1.97 IC1.D5 IC1.61
N$17
  Top 0.61: IC1.62 IC1.D4 IC1.98 JP33.2 JP33.1
N$18
  Top 0.61: JP32.1 JP32.2 IC1.99 IC1.D3 IC1.63
N$19
  Top 0.61: IC1.64 IC1.D2 IC1.100 JP30.2 JP30.1
N$20
  Top 0.61: JP29.3 JP29.2 IC1.101 IC1.D1 IC1.65
N$21
  Top 0.61: IC1.66 IC1.D0 IC1.102 JP28.2 JP28.3
N$22
  Top 0.61: R47.2 IC1.13 IC1.B5 IC1.49
  Bottom 0.61: R47.2 IC1.B5
N$23
  Top 0.61: JP1.12 55.88,13.16 R25.2
  Bottom 0.305: R25.2 57.15,13.03
  Bottom 0.61: R25.2 59.69,13.03 JP1.12
N$24
  Top 0.61: JP38.3 JP38.2 IC1.92 IC1.RST IC1.56
N$25
  Top 0.61: JP44.3 JP44.2 IC1.107 IC1.C1 IC1.71
N$26
  Top 0.61: JP17.12 55.88,15.7 R25.1
  Bottom 0.305: R25.1 57.15,15.83
  Bottom 0.61: R25.1 59.69,15.83 JP17.12
N$27
  Top 0.61: IC1.72 IC1.C0 IC1.108 JP45.2 JP45.3
N$28
  Top 0.61: R26.1 JP6.8
  Bottom 0.61: R26.1 JP6.8
N$29
  Top 0.305: R32.2 JP18.1
  Bottom 0.61: R32.2 JP18.1
N$30
  Top 0.305: R29.2 JP16.1
  Bottom 0.61: R29.2 JP16.1
N$31
  Top 0.61: R29.1 JP6.7
  Bottom 0.61: R29.1 JP6.7
N$32
  Top 0.61: R48.2 IC1.14 IC1.B4 IC1.50
  Bottom 0.61: R48.2 IC1.B4
N$33
  Top 0.61: JP16.12 55.88,18.24 R31.2
  Bottom 0.305: R31.2 57.15,18.11
  Bottom 0.61: R31.2 59.69,18.11 JP16.12
N$34
  Top 0.61: JP18.12 55.88,20.78 R31.1
  Bottom 0.305: R31.1 57.15,20.91
  Bottom 0.61: R31.1 59.69,20.91 JP18.12
N$35
  Top 0.61: R49.2 IC1.15 IC1.B3 IC1.51
  Bottom 0.61: R49.2 IC1.B3
N$36
  Top 0.61: R32.1 JP6.6
  Bottom 0.61: R32.1 JP6.6
N$37
  Top 0.305: JP20.1 R38.2
  Bottom 0.61: R38.2 JP20.1
N$38
  Top 0.61: JP36.1 JP36.2 IC1.95 IC1.D7 IC1.59
N$39
  Top 0.61: IC1.60 IC1.D6 IC1.96 JP35.2 JP35.1
N$40
  Top 0.305: JP19.1 R35.2
  Bottom 0.61: R35.2 JP19.1
N$41
  Top 0.61: R50.2 IC1.16 IC1.B2 IC1.52
  Bottom 0.61: R50.2 IC1.B2
N$43
  Top 0.61: JP6.5 R35.1
  Bottom 0.61: R35.1 JP6.5
N$44
  Top 0.61: IC1.53 IC1.B1 IC1.17 R51.2
  Bottom 0.61: R51.2 IC1.B1
N$45
  Top 0.61: R52.2 IC1.18 IC1.B0 IC1.54
  Bottom 0.61: R52.2 IC1.B0
N$53
  Top 0.61: JP19.12 55.88,23.32 R37.2
  Bottom 0.305: R37.2 57.15,23.19
  Bottom 0.61: R37.2 59.69,23.19 JP19.12
N$54
  Top 0.61: R37.1 59.69,25.99 JP20.12
  Bottom 0.305: R37.1 57.15,25.99
  Bottom 0.61: R37.1 59.69,25.99 JP20.12
N$57
  Top 0.61: JP6.4 R38.1
  Bottom 0.61: R38.1 JP6.4
N$58
  Top 0.305: JP22.1 R44.2
  Bottom 0.61: R44.2 JP22.1
N$59
  Bottom 0.406: R11.1 21.97,19.32 JP11.1
N$60
  Bottom 0.406: T2.1 31.6,19.3 R11.2 33.91,19.32 R9.2
N$61
  Bottom 0.406: T2.3 JP9.1
N$62
  Bottom 0.406: T2.2 30.48,23.64 28.57,23.64 27.62,24.59 JP10.1
N$63
  Top 0.305: JP21.1 R41.2
  Bottom 0.61: R41.2 JP21.1
N$64
  Top 0.61: JP6.3 R41.1
  Bottom 0.61: R41.1 JP6.3
N$68
  Top 0.61: R43.2 59.69,28.27 JP21.12
  Bottom 0.305: R43.2 57.15,28.27
  Bottom 0.61: R43.2 59.69,28.27 JP21.12
N$69
  Top 0.61: JP22.12 55.88,30.94 R43.1
  Bottom 0.305: R43.1 57.15,31.07
  Bottom 0.61: R43.1 59.69,31.07 JP22.12
N$72
  Top 0.61: JP6.2 R44.1
  Bottom 0.61: R44.1 JP6.2
RX
  Top 0.813: JP26.4 JP27.4 IC1.4 IC1.RX IC1.40
TX
  Top 0.813: JP26.3 JP27.3 IC1.3 IC1.TX IC1.39
V_BATT
  Top 0.61: IC1.57 IC1.VBAT IC1.93 JP37.2 JP37.3

### Text on the board
tNames: VBATT | 3v3 | D7 | D6 | D5 | D4 | D3 | D2 | D1 | D0 | C5 | C4 | C3 | C2 | C1 | C0 | 3v3 | RST | GND | 3v3 | ThingySticks.com/Electron | V1 | GND | GND | VIn | GND | Tx | RX | WKP | DAC | A5 | A4 | A3 | A2 | A1 | A0 | B5 | B4 | B3 | B2 | B1 | B0
bNames: VBATT | 3v3 | D7 | D6 | D5 | D4 | D3 | D2 | D1 | D0 | C5 | C4 | C3 | C2 | C1 | C0 | 3v3 | RST | GND | 3v3 | GND | GND | VIn | GND | Tx | RX | WKP | DAC | A5 | A4 | A3 | A2 | A1 | A0 | B5 | B4 | B3 | B2 | B1 | B0